# EAGLE design lab2sch (EAGLE 9.6.2)
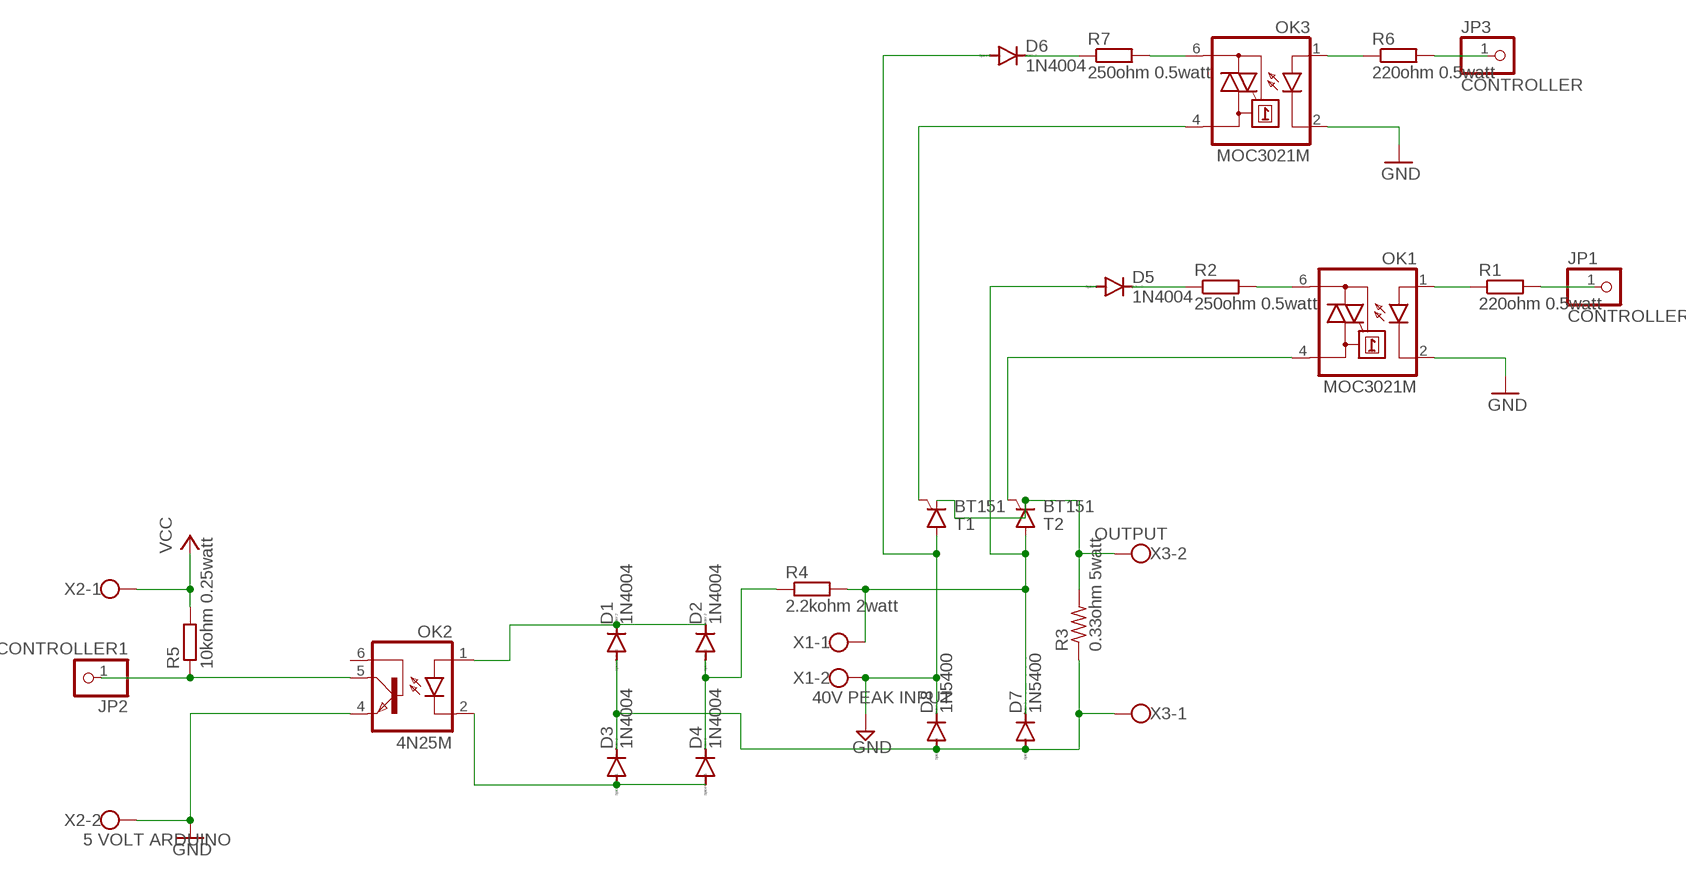
[diagram p0: schematic, sheet 1]

## Parts
D1  1N4004  [DO41-10]
D2  1N4004  [DO41-10]
D3  1N4004  [DO41-10]
D4  1N4004  [DO41-10]
D5  1N4004  [DO41-10]
D6  1N4004  [DO41-10]
D7  1N5400  [DO201-15]
D8  1N5400  [DO201-15]
JP1  CONTROLLER  PINHD-1X1  [1X01]
JP2  CONTROLLER1  PINHD-1X1  [1X01]
JP3  CONTROLLER  PINHD-1X1  [1X01]
OK1  MOC3021M  [DIL06]
OK2  4N25M  [DIL06]
OK3  MOC3021M  [DIL06]
R1  220ohm 0.5watt  R-EU_0204/7  [0204/7]
R2  250ohm 0.5watt  R-EU_0207/10  [0207/10]
R3  0.33ohm 5watt  R-US_0617/22  [0617/22]
R4  2.2kohm 2watt  R-EU_0204/7  [0204/7]
R5  10kohm 0.25watt  R-EU_0204/7  [0204/7]
R6  220ohm 0.5watt  R-EU_0204/7  [0204/7]
R7  250ohm 0.5watt  R-EU_0207/10  [0207/10]
T1  BT151  [TO220CL]
T2  BT151  [TO220CL]
X1  40V PEAK INPUT  W237-102  [W237-102]
X2  5 VOLT ARDUINO  W237-102  [W237-102]
X3  OUTPUT  W237-102  [W237-102]

## Nets
GND: D6.A D8.C OK1.2(C) OK2.4(EMI) OK3.2(C) T1.A X1.2 X2.2
N$1: OK1.1(A) R1.1
N$2: OK1.6(A2) R2.2
N$3: D5.C R2.1
N$4: OK1.4(A1) T2.G
N$5: R3.2 T1.C T2.C X3.2
N$6: D3.A D4.A OK2.2(C)
N$7: D1.C D2.C OK2.1(A)
N$9: D2.A D4.C R4.1
N$10: D1.A D3.C D7.A D8.A R3.1 X3.1
N$11: JP1.1 R1.2
N$12: OK3.1(A) R6.1
N$13: JP2.1 OK2.5(COL) R5.1
N$14: OK3.6(A2) R7.2
N$15: D6.C R7.1
N$16: OK3.4(A1) T1.G
N$18: JP3.1 R6.2
N$19: D5.A D7.C R4.2 T2.A X1.1
VCC: R5.2 X2.1
Unconnected: OK2.6(BAS)

## Library data of the parts
D1-D6 = diode:1N4004: DIODE general purpose rectifier, 1 A
D7 D8 = diode:1N5400: DIODE standard rectifier, 3 A, 50 V (Motorola)
JP1-JP3 = pinhead:PINHD-1X1: PIN HEADER
OK1 OK3 = optocoupler:MOC30*M: RANDOM-PHASE OPTOISOLATORS TRIAC DRIVER OUTPUT Source: http://www.fairchildsemi.com MOC3020-M.pdf; MF: FAIRCHILD SEMICONDUCTOR; MPN: MOC3021-M; OC_FARNELL: 1021365; OC_NEWARK: 95B7895
OK2 = optocoupler:4N*?M: General Purpose 6-Pin Phototransistor Optocouplers Source: http://www.fairchildsemi.com/ds/4N/4N35-M.pdf; MPN: 4N25-M; OC_FARNELL: 1021349; OC_NEWARK: 98K9084
R1 R2 R4-R7 = rcl:R-EU_: RESISTOR, European symbol; SPICEPREFIX: R
R3 = rcl:R-US_: RESISTOR, American symbol; SPICEPREFIX: R
T1 T2 = triac:BT151: THYRISTOR
X1-X3 = con-wago-500:W237-102: WAGO SCREW CLAMP; MPN: 237-102; OC_FARNELL: unknown; OC_NEWARK: 70K9898

## Board
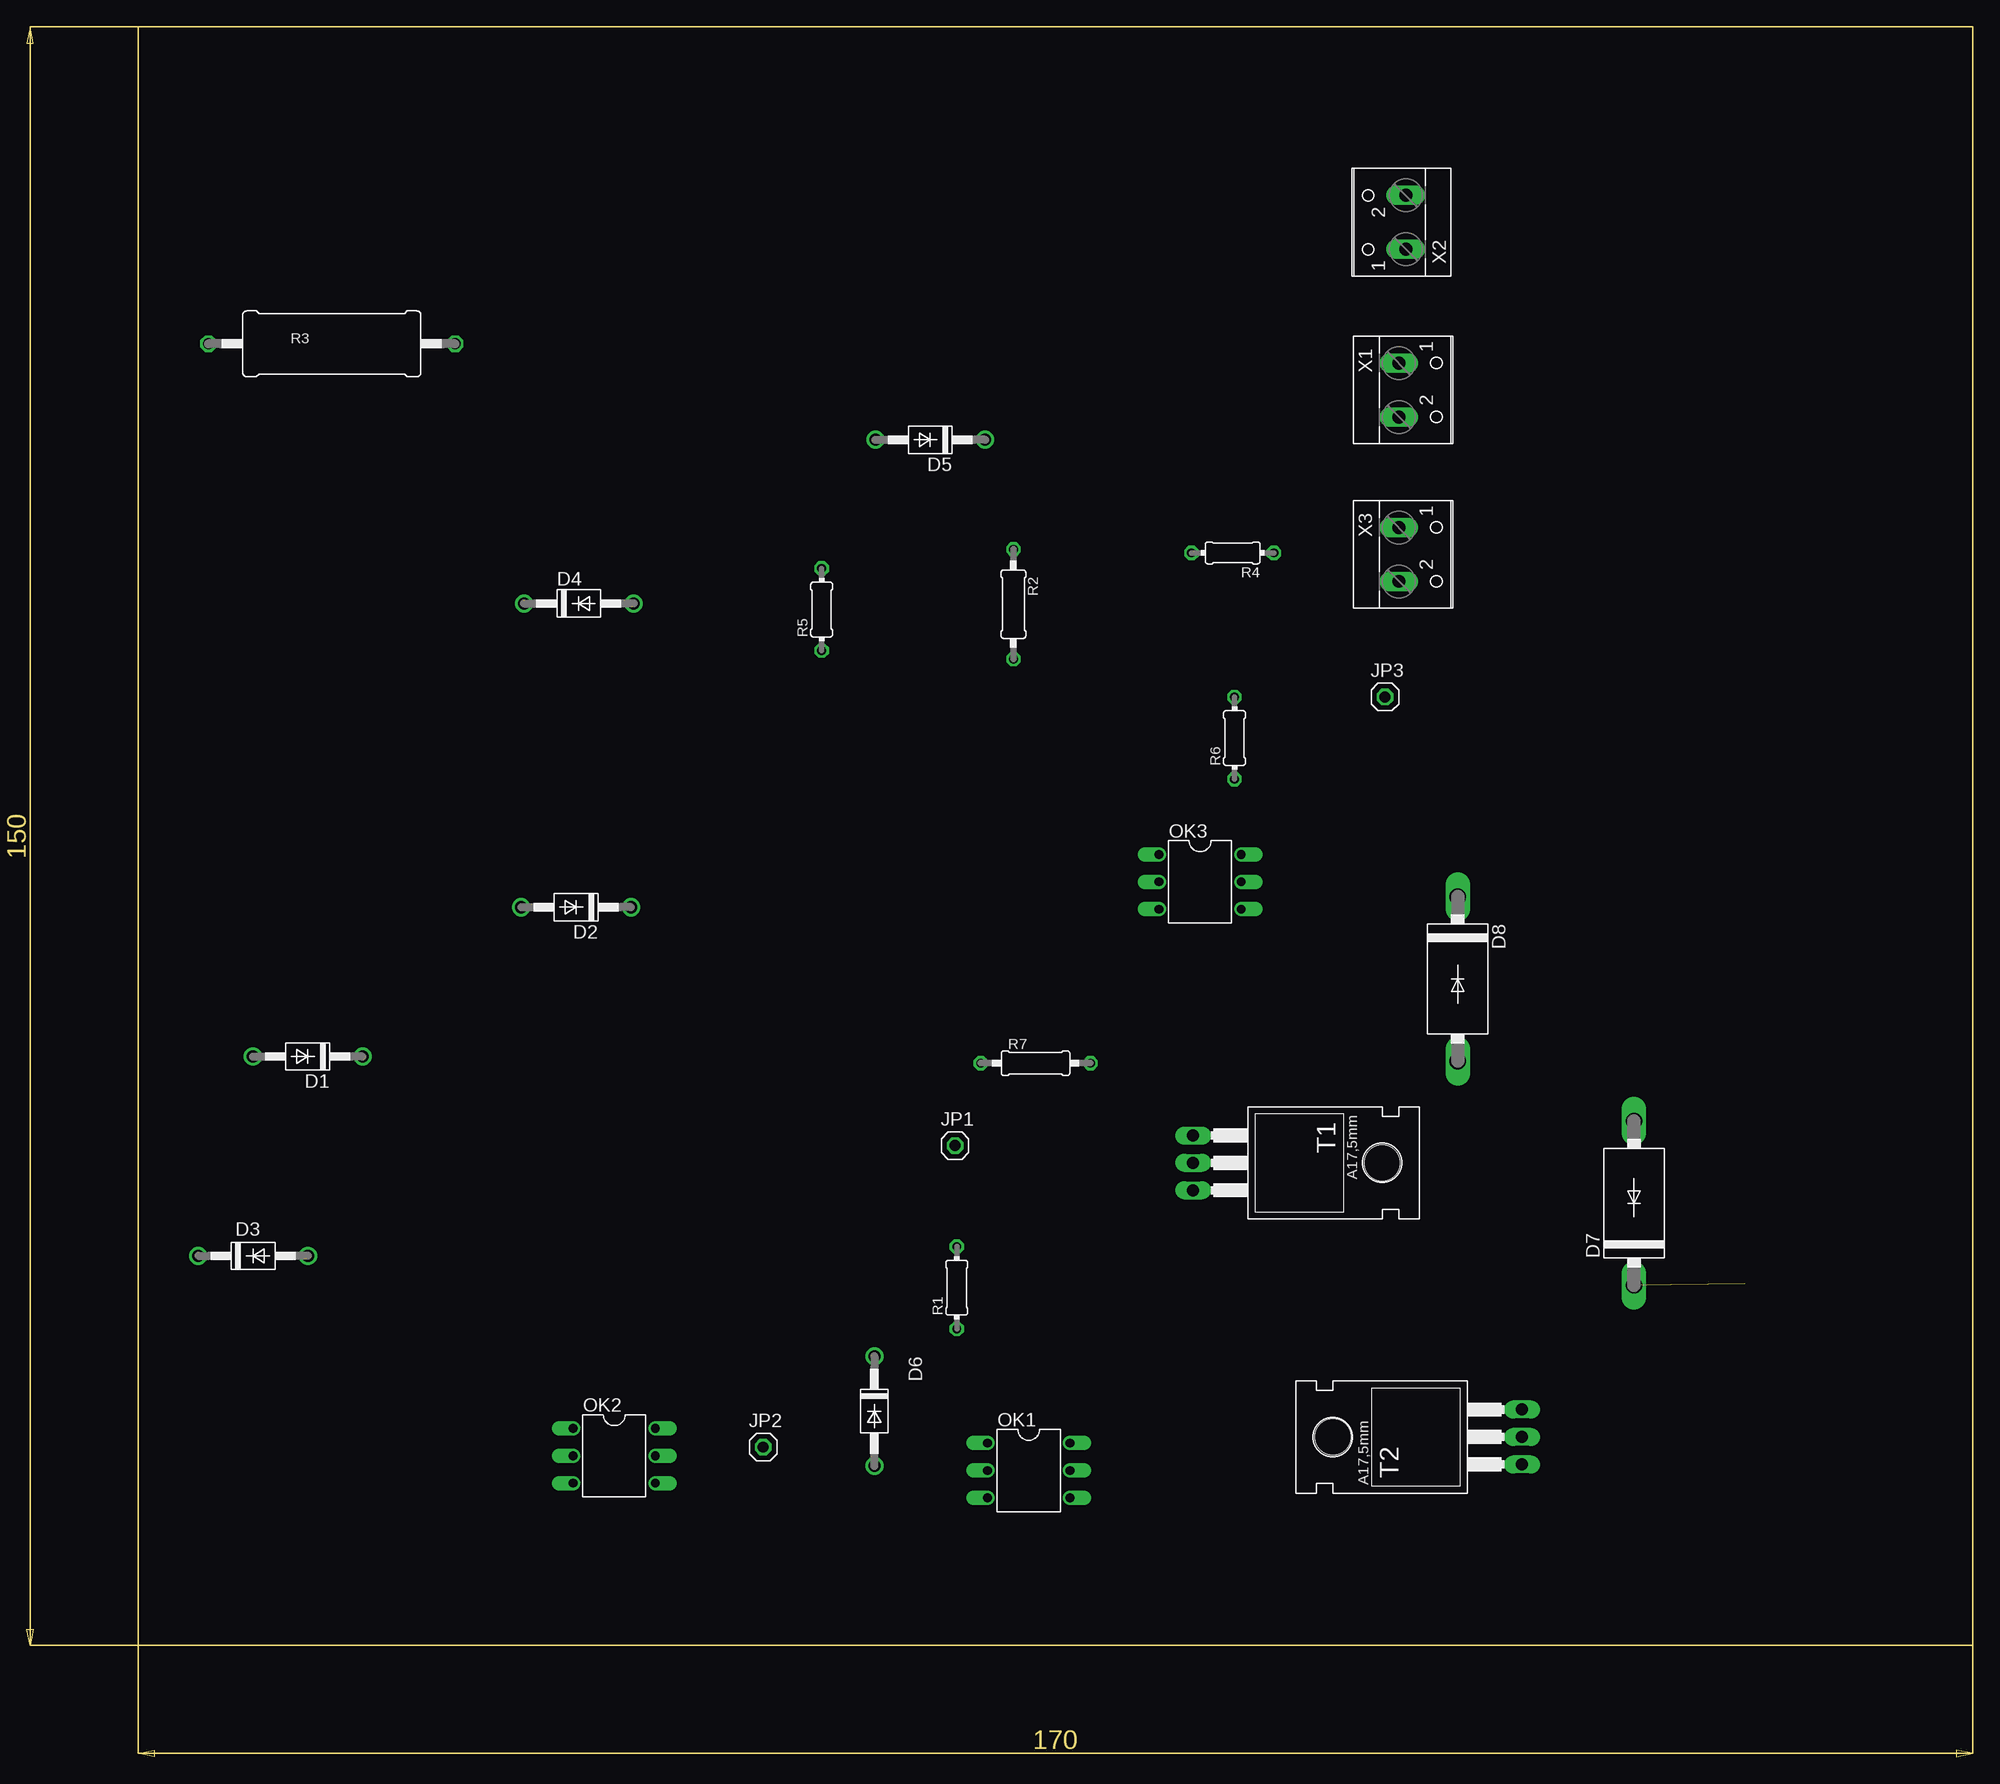
[diagram p1: board, top side]
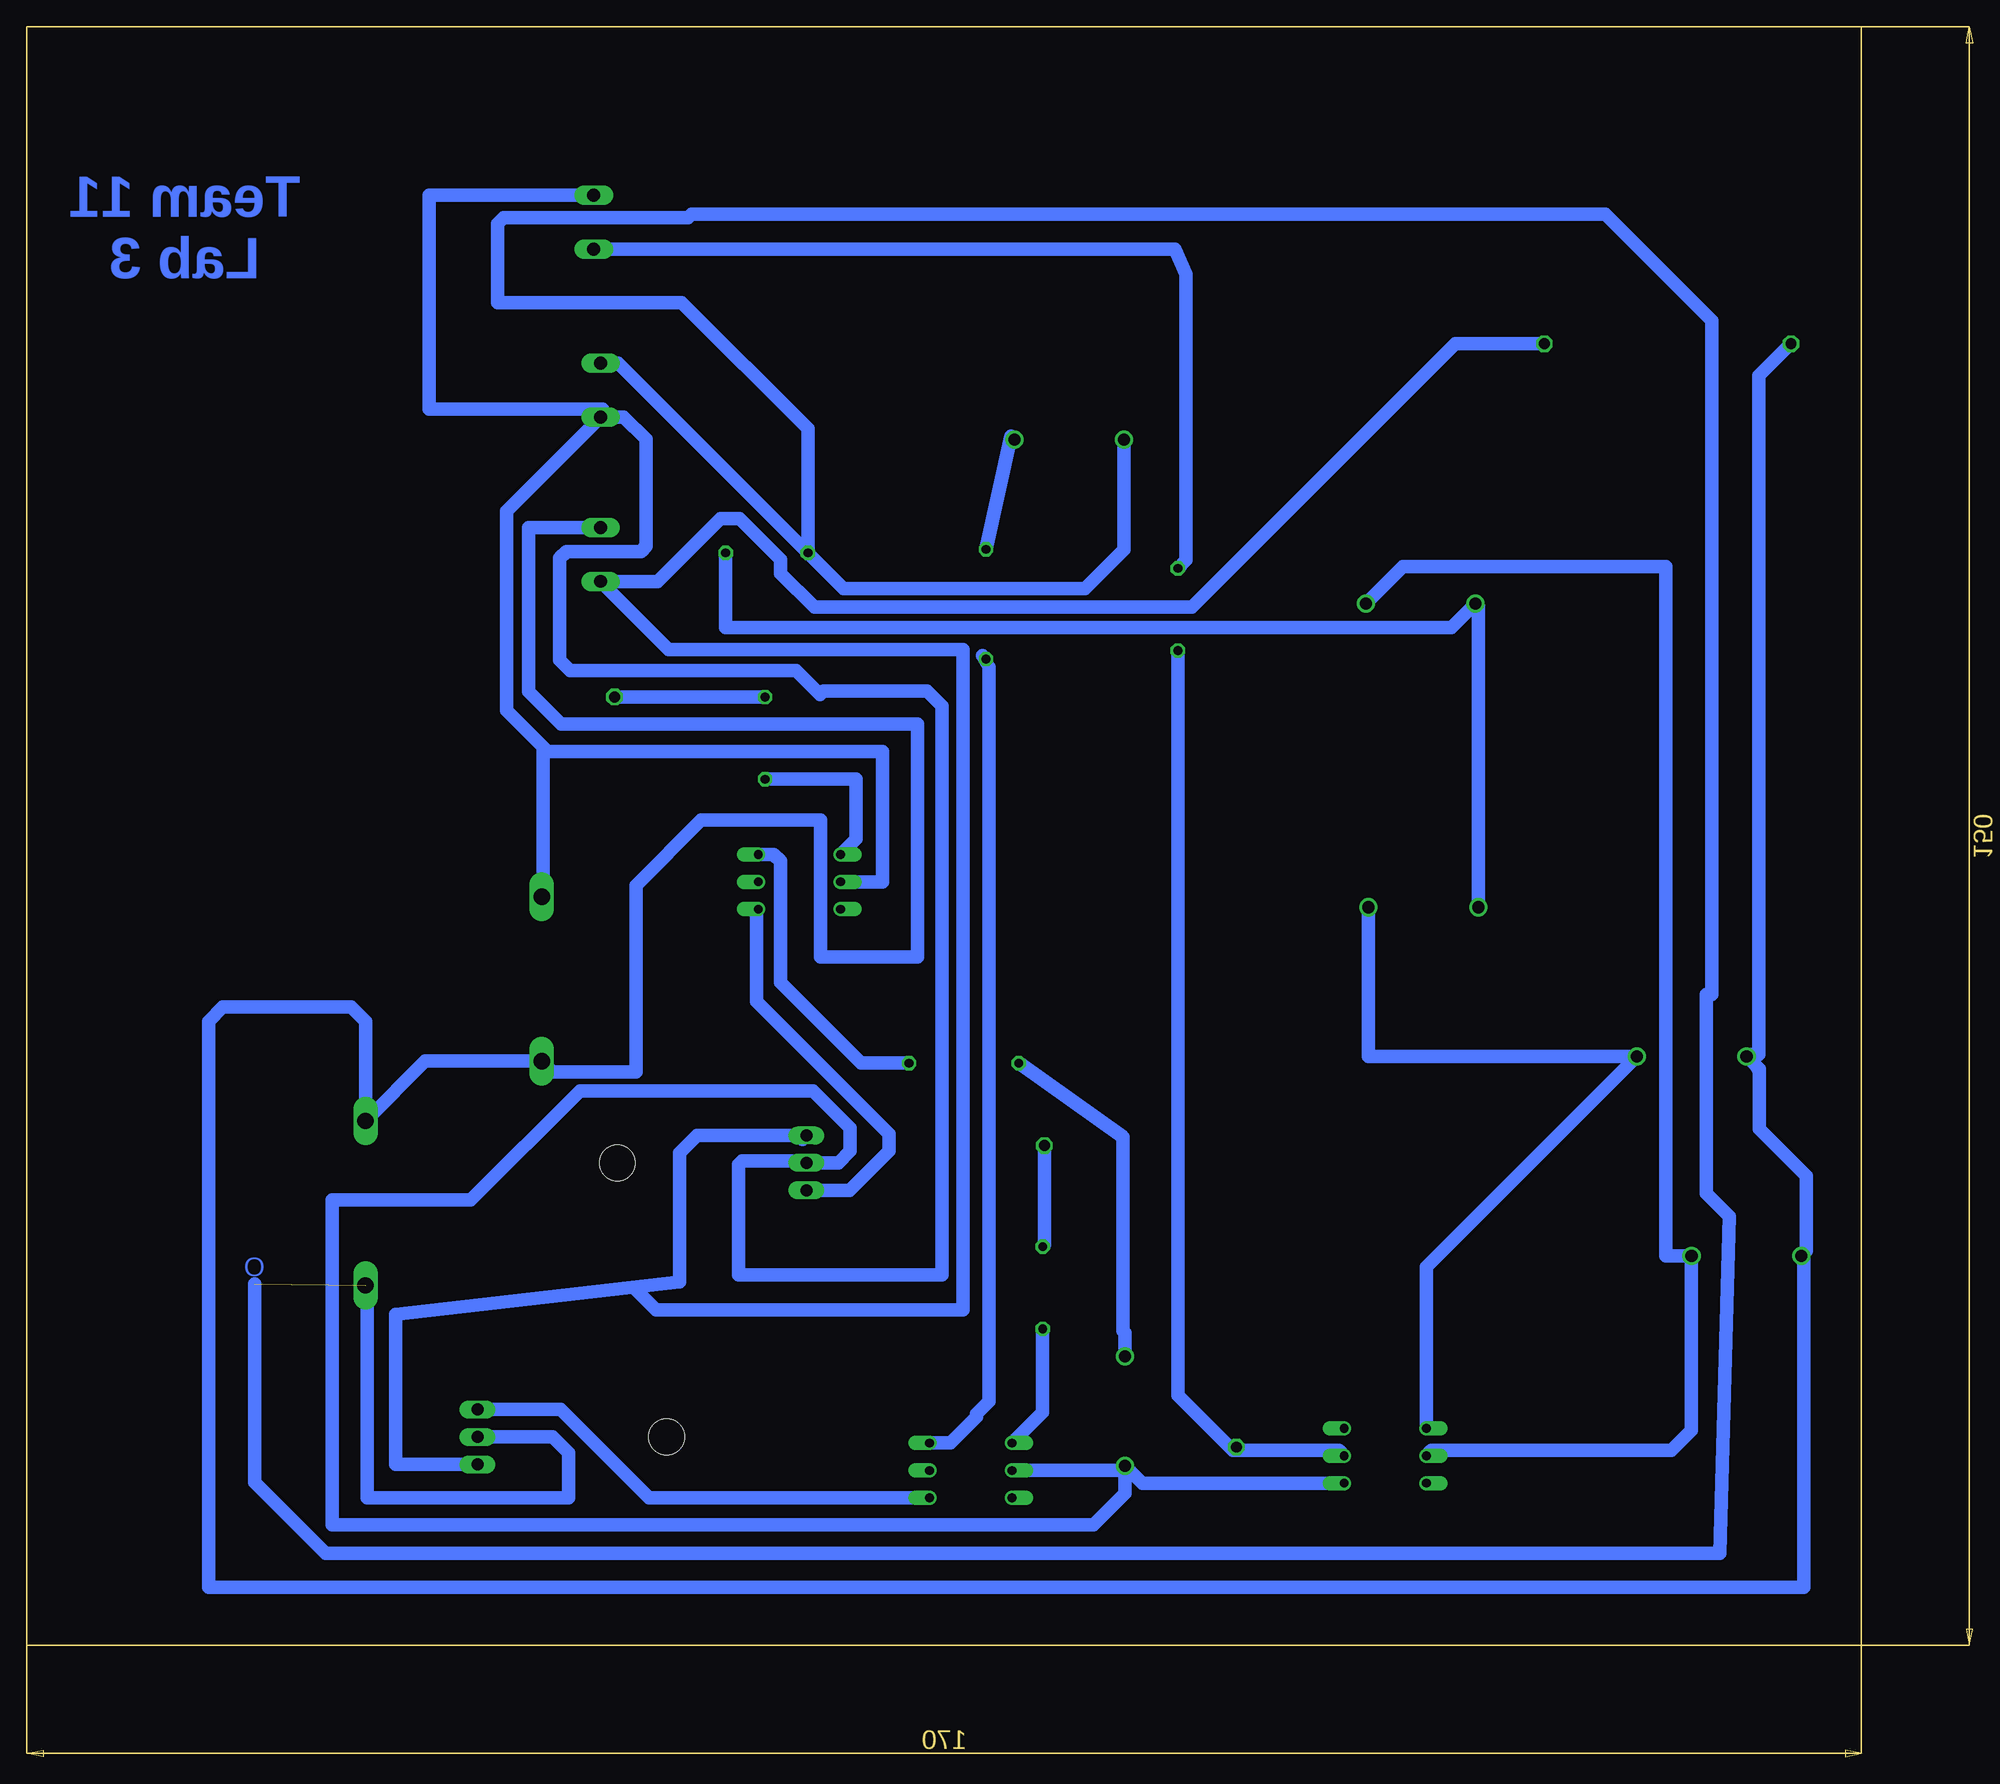
[diagram p2: board, bottom side, seen from below]

Size 170 x 150 mm. Coordinates in mm from the lower left corner, seen from the top.
Outline: 0,0 170,0 170,150 0,150 0,0
Copper layers (1*16): Top 0.035mm / dielectric 1.5mm / Bottom 0.035mm
Design rules "default *": minimum track width 50mil, minimum drill 0.35mm, track to track 15mil, track to pad 6mil, pad to pad 6mil, via to via 6mil, smd to smd 6mil, copper to edge 40mil, drill to drill 6mil, minimum pad ring 10mil, minimum via ring 8mil, stop-mask expansion 4mil, vias tented up to drill 0mil, thermal gap 10mil

### Footprints (pad centres in the part's own frame; a part is rotated, then mirrored left to right if it is on the bottom)
DO41-10 = drill 1.118: A 5.08,0; C -5.08,0
DO201-15 = drill 1.499 long: A 7.62,0; C -7.62,0
1X01 = drill 1.016 octagon: 1 0,0
DIL06 = drill 0.813 offset: 1 -2.54,-3.81; 2 0,-3.81; 3 2.54,-3.81; 4 2.54,3.81; 5 0,3.81; 6 -2.54,3.81
0204/7 = drill 0.813 octagon: 1 -3.81,0; 2 3.81,0
0207/10 = drill 0.813 octagon: 1 -5.08,0; 2 5.08,0
0617/22 = drill 1.016 octagon: 1 -11.43,0; 2 11.43,0
TO220CL = drill 1.118 long: A 0,-6.35; C -2.54,-6.35; G 2.54,-6.35 | hole 3.302: 0,11.176
W237-102 = drill 1.194 long: 1 -2.5,-1.27; 2 2.5,-1.27

### Placement (x,y rotation side)
D1  15.72,54.59 180 top
D2  40.59,68.42 180 top
D3  10.66,36.11 0 top
D4  40.84,96.57 0 top
D5  73.41,111.74 180 top
D6  68.23,21.72 270 top
D7  138.63,40.99 90 top
D8  122.29,61.78 270 top
JP1  75.71,46.33 0 top
JP2  57.93,18.39 0 top
JP3  115.55,87.91 0 top
OK1  82.54,16.22 270 top
OK2  44.13,17.59 270 top
OK3  98.42,70.78 270 top
R1  75.87,33.16 90 top
R2  81.12,96.51 270 top
R3  17.95,120.64 0 top
R4  101.44,101.26 180 top
R5  63.35,96.01 90 top
R6  101.61,84.1 90 top
R7  83.17,53.97 0 top
T1  104.12,44.73 270 top
T2  121.9,19.33 90 top
X1  118.11,116.36 270 top
X2  116.21,131.9 90 top
X3  118.11,101.12 270 top

### Tracks (layer width: path | path; a pad name or v marks a point on that pad's centre or on a via)
GND
  Bottom 1.27: X2.2 132.74,134.4 132.74,114.6 116.68,114.6 116.68,114.02 X1.2 | X1.2 125.57,105.13 125.57,86.66 121.76,82.85 | 121.76,82.85 122.18,82.85 122.18,69.32 D8.C | 121.76,82.85 90.72,82.85 90.72,70.78 OK3.2 | OK2.4 66.64,15.05 D6.A | OK1.2 68.65,16.22 D6.A | T1.A 97.69,44.81 | X1.2 114.69,113.86 112.63,111.79 112.63,101.88 113.11,101.4 119.98,101.4 120.62,100.76 120.62,91.33 119.66,90.37 98.72,90.37 96.48,88.13 96.16,88.45 86.57,88.45 85.2,87.08 85.2,34.36 104.05,34.36 104.05,44.57 103.72,44.9 97.94,44.9 T1.A | T1.A 94.79,44.73 93.7,45.82 93.7,47.95 97.17,51.41 118.75,51.41 128.87,41.3 141.7,41.3 141.7,11.18 71.16,11.18 68.23,14.11 D6.A
N$1
  Bottom 1.27: R1.1 75.87,21.62 OK1.1
N$2
  Bottom 1.27: R2.2 81.43,91.74 80.86,90.69 80.86,22.62 82.01,21.47 82.01,21.18 84.43,18.76 OK1.6
N$3
  Bottom 1.27: D5.C 78.81,112.06 R2.1
N$4
  Bottom 1.27: T2.G 120.55,21.87 112.36,13.68 OK1.4
N$5
  Bottom 1.27: T2.C 135.83,16.79 135.83,30.69 109.53,33.69 109.53,45.66 107.92,47.27 T1.C 98.14,46.9 | R3.2 37.62,120.64 62.05,96.22 97.02,96.22 100.17,99.36 100.17,100.63 103.98,104.44 105.74,104.44 111.56,98.62 X3.2 110.54,92.32 83.26,92.32 83.26,31.11 111.69,31.11 113.59,33.02
N$6
  Bottom 1.27: OK2.2 39.83,18.08 17.62,18.08 15.74,19.96 D3.A 18.13,36.11 18.13,99.99 42.5,99.99 D4.A
N$7
  Bottom 1.27: OK2.1 40.32,35.07 D1.C 45.67,54.59 D2.C
N$9
  Bottom 1.27: D2.A 35.51,96.32 D4.C 37.99,94.34 105.25,94.34 R4.1
N$10
  Bottom 1.27: R3.1 9.48,117.67 9.48,54.78 10.45,54.78 9.47,53.23 | 5.71,36.05 5.65,36.11 D3.C | D7.A 138.5,48.48 | 9.47,53.23 9.47,47.89 5.1,43.52 5.1,36.59 D3.C | D3.C 5.36,35.89 5.36,5.38 153.18,5.38 153.18,57.85 151.85,59.18 139.97,59.18 138.63,57.84 D7.A | X3.1 123.52,103.62 123.52,88.42 120.49,85.39 87.47,85.39 87.47,63.8 96.46,63.8 96.46,76.5 107.51,76.5 113.55,70.46 113.55,53.15 121.28,53.15 D8.A 133.09,54.16 D7.A | D1.A 9.47,53.42 9.47,53.23
N$11
  Bottom 1.27: JP1.1 75.71,37.13 R1.2
N$12
  Bottom 1.27: OK3.1 93.17,74.76 93.17,80.29 R6.1
N$13
  Bottom 1.27: OK2.5 48.43,18.08 58.26,18.08 | 58.26,18.08 57.95,18.39 JP2.1 | R5.1 63.35,23.17 58.26,18.08
N$14
  Bottom 1.27: R7.2 92.71,53.97 100.17,61.43 100.17,72.69 100.8,73.32 OK3.6
N$15
  Bottom 1.27: D6.C 68.23,28.96 68.42,29.15 68.42,47.13 R7.1
N$16
  Bottom 1.27: OK3.4 102.4,68.07 102.4,59.67 90.13,47.41 90.13,45.83 93.78,42.19 T1.G
N$18
  Bottom 1.27: R6.2 JP3.1
N$19  (1 unrouted)
  Bottom 1.27: R4.2 94.34,97.97 71.94,97.97 68.33,101.58 D5.A | R4.2 115.23,118.86 X1.1 | R4.2 97.63,112.76 109.33,124.46 126.39,124.46 126.39,131.76 125.82,132.33 108.75,132.33 108.42,132.66 23.75,132.66 13.86,122.78 13.86,60.31 14.35,60.31 14.35,41.89 12.23,39.78 13.11,8.54 142.33,8.54 148.91,15.11 148.91,33.51 | T2.A 121.28,19.33 119.81,17.85 119.81,13.69 138.46,13.69 138.46,33.2 D7.C 138.6,33.37 138.58,33.35
VCC
  Bottom 1.27: R5.2 62.58,100.59 62.58,127.08 63.62,129.4 X2.1

### Text on the board
Bottom: Team 11 / Lab 3 | O